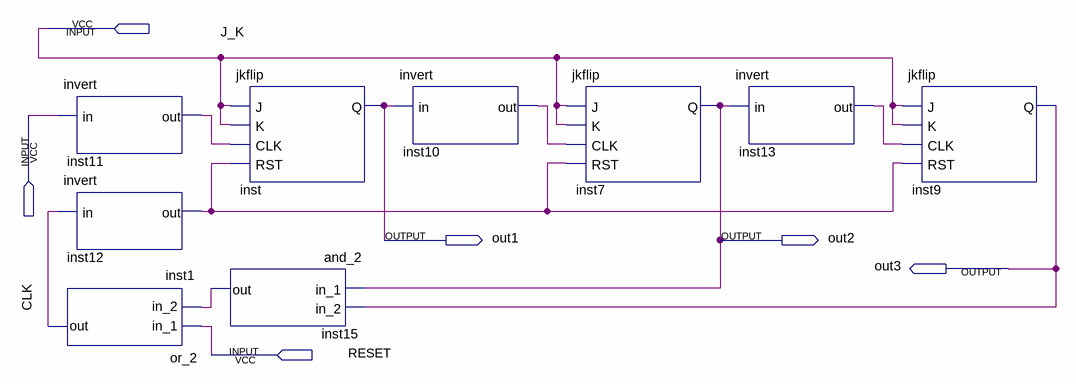
[diagram p0: schematic sheet]
// Quartus schematic mod6.bdf as structural Verilog: 9 symbols, 6 pins
module mod6 (
  input  J_K,
  input  CLK,
  input  RESET,
  output out1,
  output out2,
  output out3
);

  wire inst1_out, inst10_out, inst11_out, inst12_out, inst13_out, inst15_out;

  invert inst11 (.in(CLK), .out(inst11_out));
  invert inst12 (.in(inst1_out), .out(inst12_out));
  or_2 inst1 (.in_1(RESET), .in_2(inst15_out), .out(inst1_out));
  jkflip inst (.J(J_K), .K(J_K), .CLK(inst11_out), .RST(inst12_out), .Q(out1));
  and_2 inst15 (.in_1(out2), .in_2(out3), .out(inst15_out));
  invert inst10 (.in(out1), .out(inst10_out));
  jkflip inst7 (.J(J_K), .K(J_K), .CLK(inst10_out), .RST(inst12_out), .Q(out2));
  invert inst13 (.in(out2), .out(inst13_out));
  jkflip inst9 (.J(J_K), .K(J_K), .CLK(inst13_out), .RST(inst12_out), .Q(out3));
endmodule
